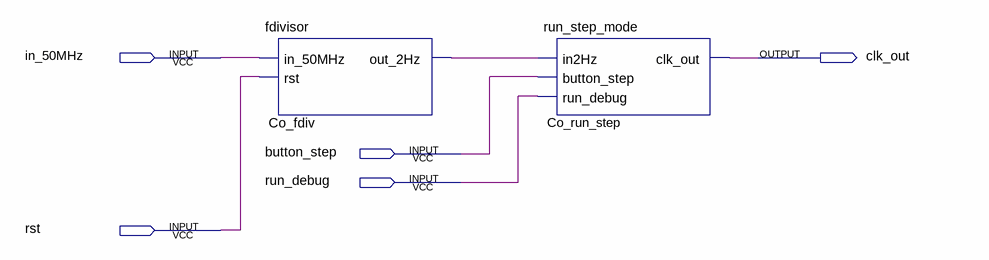
[diagram p0: schematic sheet]
// Quartus schematic debugger.bdf as structural Verilog: 2 symbols, 5 pins
module debugger (
  input  in_50MHz,
  input  button_step,
  input  run_debug,
  input  rst,
  output clk_out
);

  wire Co_fdiv_out_2hz;

  fdivisor Co_fdiv (.in_50MHz(in_50MHz), .rst(rst), .out_2Hz(Co_fdiv_out_2hz));
  run_step_mode Co_run_step (
    .in2Hz(Co_fdiv_out_2hz), .button_step(button_step), .run_debug(run_debug), .clk_out(clk_out));
endmodule
